# Altium project E17-09-PCU.PrjPcb
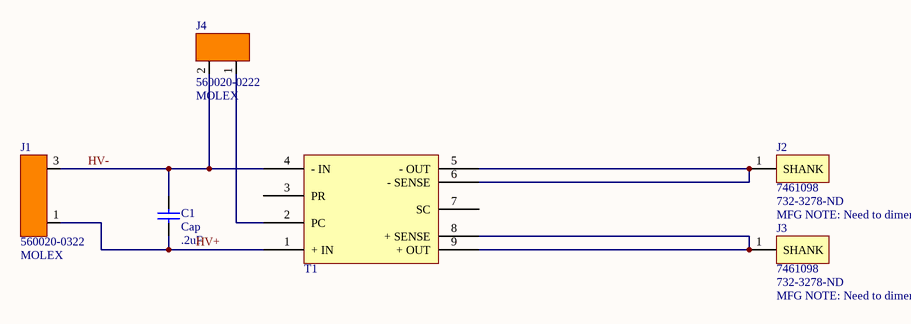
[diagram p0: E17-09-PCU.SchDoc]
1 sheet, 6 parts. Net scope: global (net labels, ports and power ports of the same name join across sheets).
Board file: E17-09-PCU.PcbDoc

## Sheet E17-09-PCU.SchDoc
size A

### Parts
C1  Cap  value .2uF  [B32922H3204]
J1  MPN: 560020-0322  MANUFACTURER: MOLEX  [MOLEX_DURACLIK_3 RED - VERT  HV]  (hidden comment: 560020-0322_HV)
J2  7461098  Supplier Part Number 1: 732-3278-ND  MFG NOTE: Need to dimension  [7461098]
J3  7461098  Supplier Part Number 1: 732-3278-ND  MFG NOTE: Need to dimension  [7461098]
J4  MANUFACTURER: MOLEX  [MOLEX_DURACLIK_2 RED VERT]  (hidden comment: 560020-0222)
T1  DC to DC  [PCBComponent_1]  (value not drawn)

### Nets
HV+: C1.1 J1.1 T1.1(+_IN)
HV-: C1.2 J1.3 J4.2 T1.4(-_IN)
NetJ2_1: J2.1(SHANK) T1.5(-_OUT) T1.6(-_SENSE)
NetJ3_1: J3.1(SHANK) T1.8(+_SENSE) T1.9(+_OUT)
NetJ4_1: J4.1 T1.2(PC)

Not connected (* = marked no-connect by the designer): T1 3(PR) 7(SC)

### Library data of the parts
C1 = Cap: Capacitor; Published: 8-Jun-2000; LatestRevisionDate: 17-Jul-2002; LatestRevisionNote: Re-released for DXP Platform.; PackageReference: C1206; Publisher: Altium Limited
J1 = 560020-0322_HV: MOLEX DURACLIK 3-PIN VERT RED HV; POSITIONS: 2; PLATING: Tin (Sn); CURRENT: 3; VOLTAGE: 250; UL: 94V-0; Digikey_PN: Not in production; COLOR: RED; SERIES: Duraclik; ORIENTATOIN: VERT
J2 J3 = 7461098: POWER ELEMENT SHANK M6 25PIN; Supplier 1: Digi-Key
J4 = 560020-0222: MOLEX DURACLIK 2-PIN VERT RED; POSITIONS: 2; PLATING: Tin (Sn); CURRENT: 3; VOLTAGE: 125; UL: 94V-0; Digikey_PN: Not in production; COLOR: RED; SERIES: Duraclik; ORIENTATOIN: VERT; MPN: 560020-0222
T1 = DC to DC: Isolated DC/DC Converters Maxi Family - Vin - 150, Vout - 12, Power - 500, Product Grade - C; PN: V150A12C500BL; Digikey PN: 1102-1229-ND